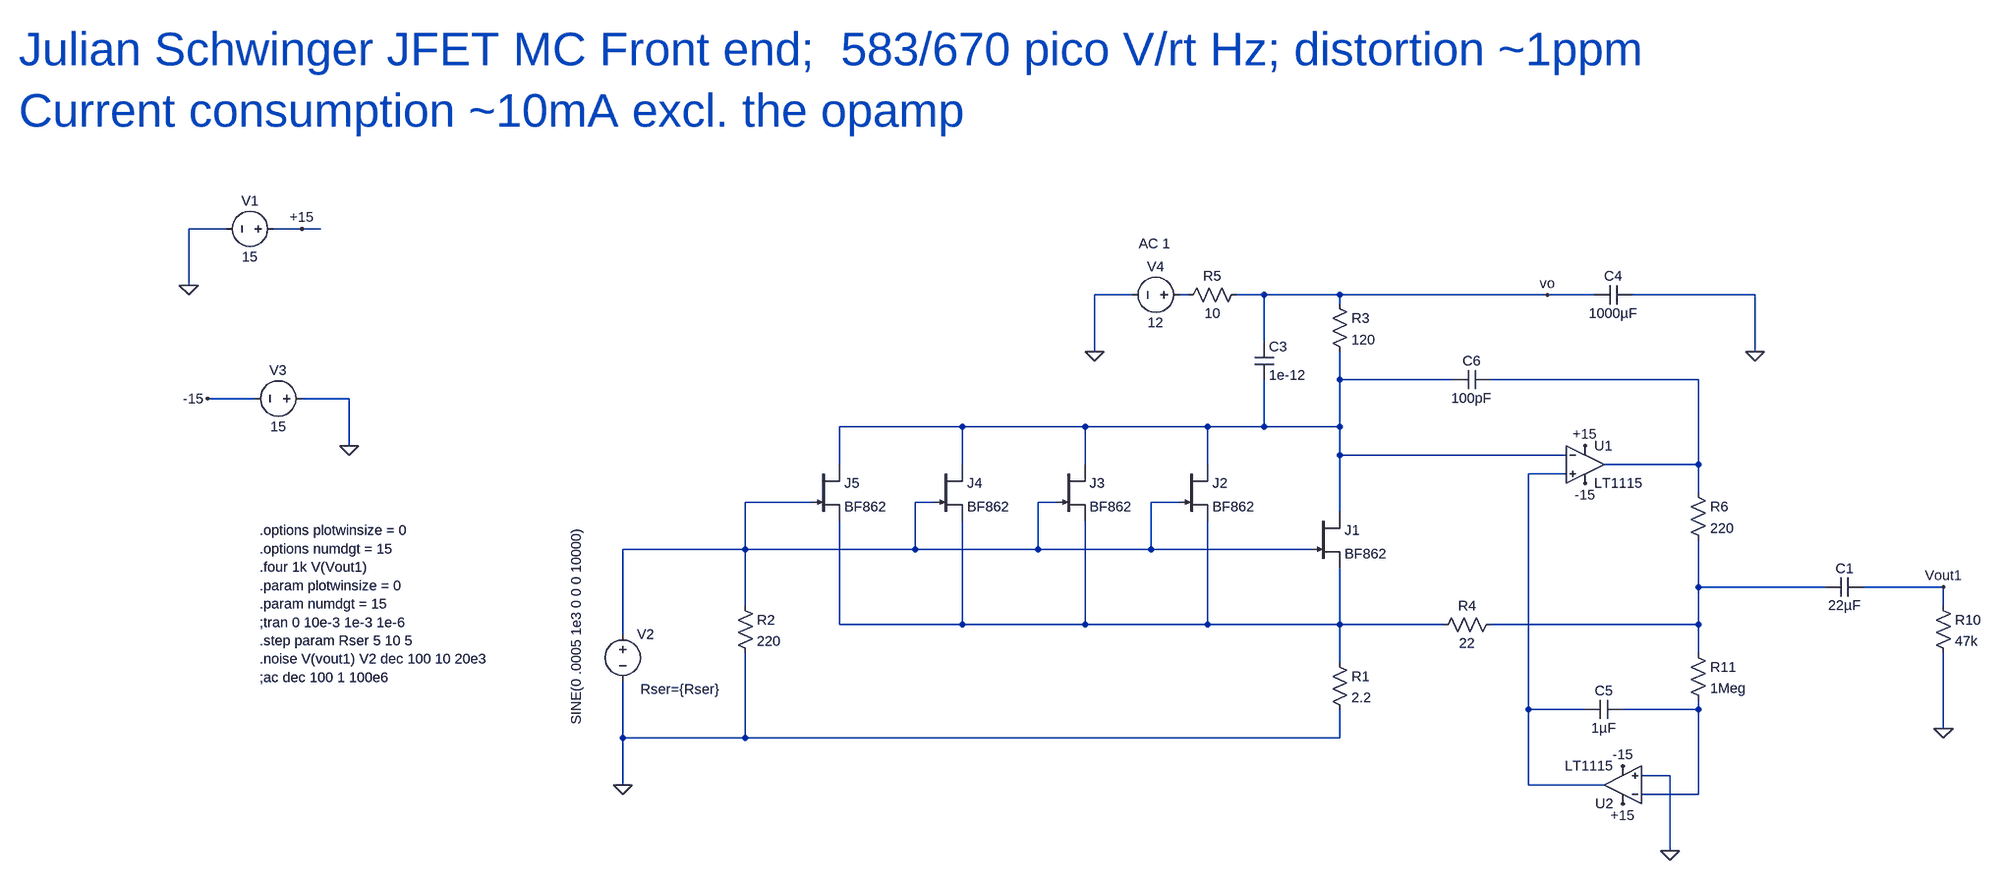
[diagram p0: schematic Schwinger.asc]
Schwinger.asc, the LTspice schematic file:
Version 4
SHEET 1 2724 680
WIRE -448 -464 -512 -464
WIRE -320 -464 -368 -464
WIRE -288 -464 -320 -464
WIRE -512 -368 -512 -464
WIRE 1088 -352 1024 -352
WIRE 1184 -352 1168 -352
WIRE 1312 -352 1264 -352
WIRE 1440 -352 1312 -352
WIRE 1792 -352 1440 -352
WIRE 1872 -352 1792 -352
WIRE 2144 -352 1936 -352
WIRE 1440 -336 1440 -352
WIRE 1312 -272 1312 -352
WIRE 1024 -256 1024 -352
WIRE 2144 -256 2144 -352
WIRE 1440 -208 1440 -256
WIRE 1632 -208 1440 -208
WIRE 2048 -208 1696 -208
WIRE -400 -176 -480 -176
WIRE -240 -176 -320 -176
WIRE 800 -128 592 -128
WIRE 1008 -128 800 -128
WIRE 1216 -128 1008 -128
WIRE 1312 -128 1312 -208
WIRE 1312 -128 1216 -128
WIRE 1440 -128 1440 -208
WIRE 1440 -128 1312 -128
WIRE -240 -96 -240 -176
WIRE 1440 -80 1440 -128
WIRE 1824 -80 1440 -80
WIRE 592 -64 592 -128
WIRE 800 -64 800 -128
WIRE 1008 -64 1008 -128
WIRE 1216 -64 1216 -128
WIRE 2048 -64 2048 -208
WIRE 2048 -64 1888 -64
WIRE 1824 -48 1760 -48
WIRE 2048 -16 2048 -64
WIRE 544 0 432 0
WIRE 752 0 720 0
WIRE 960 0 928 0
WIRE 1168 0 1120 0
WIRE 1440 16 1440 -80
WIRE 432 80 432 0
WIRE 432 80 224 80
WIRE 720 80 720 0
WIRE 720 80 432 80
WIRE 928 80 928 0
WIRE 928 80 720 80
WIRE 1120 80 1120 0
WIRE 1120 80 928 80
WIRE 1392 80 1120 80
WIRE 2048 144 2048 64
WIRE 2304 144 2048 144
WIRE 2512 144 2368 144
WIRE 432 176 432 80
WIRE 2512 176 2512 144
WIRE 592 208 592 32
WIRE 800 208 800 32
WIRE 800 208 592 208
WIRE 1008 208 1008 32
WIRE 1008 208 800 208
WIRE 1216 208 1216 32
WIRE 1216 208 1008 208
WIRE 1440 208 1440 112
WIRE 1440 208 1216 208
WIRE 1616 208 1440 208
WIRE 2048 208 2048 144
WIRE 2048 208 1696 208
WIRE 224 224 224 80
WIRE 2048 256 2048 208
WIRE 1440 272 1440 208
WIRE 1760 352 1760 -48
WIRE 1856 352 1760 352
WIRE 2048 352 2048 336
WIRE 2048 352 1920 352
WIRE 2512 384 2512 256
WIRE 224 400 224 304
WIRE 432 400 432 256
WIRE 432 400 224 400
WIRE 1440 400 1440 352
WIRE 1440 400 432 400
WIRE 2000 464 1952 464
WIRE 224 480 224 400
WIRE 1760 480 1760 352
WIRE 1888 480 1760 480
WIRE 2048 496 2048 352
WIRE 2048 496 1952 496
WIRE 2000 592 2000 464
FLAG 224 480 0
FLAG -512 -368 0
FLAG 2144 -256 0
FLAG 1792 -352 vo
FLAG 2512 384 0
FLAG -240 -96 0
FLAG -320 -464 +15
FLAG 1856 -96 +15
FLAG 1920 512 +15
FLAG -480 -176 -15
FLAG 1856 -32 -15
FLAG 1920 448 -15
FLAG 2512 144 Vout1
FLAG 2000 592 0
FLAG 1024 -256 0
SYMBOL njf 1392 16 R0
SYMATTR InstName J1
SYMATTR Value BF862
SYMBOL res 1424 256 R0
SYMATTR InstName R1
SYMATTR Value 2.2
SYMBOL res 1424 -352 R0
SYMATTR InstName R3
SYMATTR Value 120
SYMBOL voltage -352 -464 R90
WINDOW 0 -32 56 VBottom 2
WINDOW 3 32 56 VTop 2
WINDOW 123 2 56 VBottom 2
WINDOW 39 0 0 Left 2
SYMATTR InstName V1
SYMATTR Value 15
SYMBOL voltage 224 208 R0
WINDOW 3 -78 -165 VRight 2
WINDOW 123 24 50 Left 2
WINDOW 39 30 110 Left 2
SYMATTR Value SINE(0 .0005 1e3 0 0 0 10000)
SYMATTR SpiceLine Rser={Rser}
SYMATTR InstName V2
SYMBOL cap 1936 -368 R90
WINDOW 0 0 32 VBottom 2
WINDOW 3 32 32 VTop 2
SYMATTR InstName C4
SYMATTR Value 1000µF
SYMBOL res 416 160 R0
SYMATTR InstName R2
SYMATTR Value 220
SYMBOL cap 1296 -272 R0
SYMATTR InstName C3
SYMATTR Value 1e-12
SYMBOL Opamps\\LT1115 1856 -128 R0
SYMATTR InstName U1
SYMBOL res 1712 192 R90
WINDOW 0 0 56 VBottom 2
WINDOW 3 32 56 VTop 2
SYMATTR InstName R4
SYMATTR Value 22
SYMBOL cap 2368 128 R90
WINDOW 0 0 32 VBottom 2
WINDOW 3 32 32 VTop 2
SYMATTR InstName C1
SYMATTR Value 22µF
SYMBOL res 2496 160 R0
SYMATTR InstName R10
SYMATTR Value 47k
SYMBOL Opamps\\LT1115 1920 544 R180
SYMATTR InstName U2
SYMBOL res 2032 240 R0
SYMATTR InstName R11
SYMATTR Value 1Meg
SYMBOL cap 1920 336 R90
WINDOW 0 0 32 VBottom 2
WINDOW 3 32 32 VTop 2
SYMATTR InstName C5
SYMATTR Value 1µF
SYMBOL voltage -304 -176 R90
WINDOW 0 -32 56 VBottom 2
WINDOW 3 32 56 VTop 2
WINDOW 123 2 56 VBottom 2
WINDOW 39 0 0 Left 2
SYMATTR InstName V3
SYMATTR Value 15
SYMBOL cap 1696 -224 R90
WINDOW 0 0 32 VBottom 2
WINDOW 3 32 32 VTop 2
SYMATTR InstName C6
SYMATTR Value 100pF
SYMBOL voltage 1184 -352 R90
WINDOW 0 -32 56 VBottom 2
WINDOW 3 32 56 VTop 2
WINDOW 123 -71 58 VBottom 2
WINDOW 39 0 0 Left 2
SYMATTR InstName V4
SYMATTR Value 12
SYMATTR Value2 AC 1
SYMBOL res 1280 -368 R90
WINDOW 0 0 56 VBottom 2
WINDOW 3 32 56 VTop 2
SYMATTR InstName R5
SYMATTR Value 10
SYMBOL res 2032 -32 R0
SYMATTR InstName R6
SYMATTR Value 220
SYMBOL njf 1168 -64 R0
SYMATTR InstName J2
SYMATTR Value BF862
SYMBOL njf 960 -64 R0
SYMATTR InstName J3
SYMATTR Value BF862
SYMBOL njf 752 -64 R0
SYMATTR InstName J4
SYMATTR Value BF862
SYMBOL njf 544 -64 R0
SYMATTR InstName J5
SYMATTR Value BF862
TEXT -392 48 Left 2 !.options plotwinsize = 0\n.options numdgt = 15\n.four 1k V(Vout1)\n.param plotwinsize = 0\n.param numdgt = 15\n;tran 0 10e-3 1e-3 1e-6\n.step param Rser 5 10 5\n.noise V(vout1) V2 dec 100 10 20e3\n;ac dec 100 1 100e6
TEXT -800 -832 Left 6 ;Julian Schwinger JFET MC Front end;  583/670 pico V/rt Hz; distortion ~1ppm\nCurrent consumption ~10mA excl. the opamp

The netlist it stands for:
* Schwinger.asc
J1 N002 N005 N007 BF862
R1 N007 0 2.2
R3 vo N002 120
V1 +15 0 15
V2 N005 0 SINE(0 .0005 1e3 0 0 0 10000) Rser={Rser}
C4 0 vo 1000µF
R2 N005 0 220
C3 vo N002 1e-12
XU1 N004 N002 +15 -15 N003 LT1028  ; LT1115, pins In+ In- V+ V- OUT
R4 N006 N007 22
C1 Vout1 N006 22µF
R10 Vout1 0 47k
XU2 0 N008 +15 -15 N004 LT1028  ; LT1115, pins In+ In- V+ V- OUT
R11 N006 N008 1Meg
C5 N008 N004 1µF
V3 0 -15 15
C6 N003 N002 100pF
V4 N001 0 12 AC 1
R5 vo N001 10
R6 N003 N006 220
J2 N002 N005 N007 BF862
J3 N002 N005 N007 BF862
J4 N002 N005 N007 BF862
J5 N002 N005 N007 BF862
.model NJF NJF
.model PJF PJF
.lib standard.jft
.options plotwinsize = 0
.options numdgt = 15
.four 1k V(Vout1)
.param plotwinsize = 0
.param numdgt = 15
;tran 0 10e-3 1e-3 1e-6
.step param Rser 5 10 5
.noise V(vout1) V2 dec 100 10 20e3
;ac dec 100 1 100e6
* Julian Schwinger JFET MC Front end;  583/670 pico V/rt Hz; distortion ~1ppm
* Current consumption ~10mA excl. the opamp
.lib LTC.lib
.backanno
.end